# Altium schematic sheet CW308_Power.SchDoc: Target Linear Regulators
size Letter; ApprovedBy: N; Organization: NewAE Technology Inc.; Address1: 1083 Queen St., Suite 196; Address2: Halifax; Address3: NS; Address4: Canada B3H 0B2; DocumentNumber: 3; SheetNumber: 3; SheetTotal: 5; SheetApproved: YES
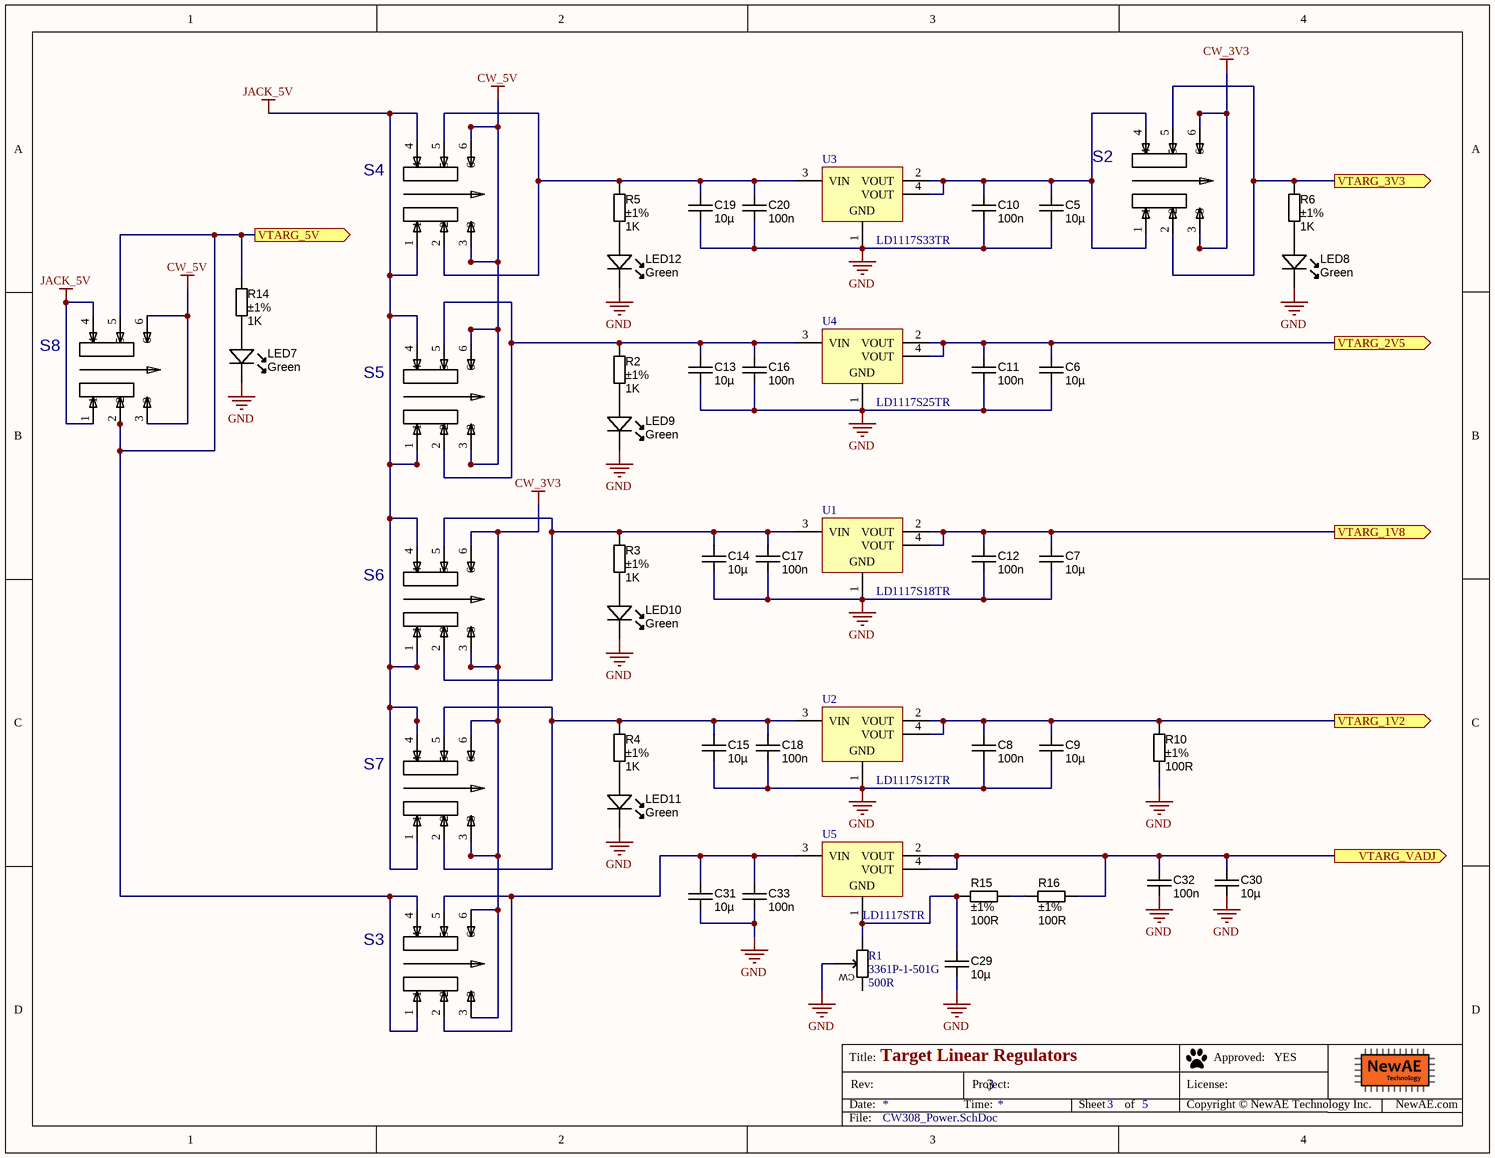
[diagram p0: CW308_Power.SchDoc]

## Parts
C5  value 10µ  [CAPC2012X135N]  (hidden comment: approved sub OK)
C6  value 10µ  [CAPC2012X135N]  (hidden comment: approved sub OK)
C7  value 10µ  [CAPC2012X135N]  (hidden comment: approved sub OK)
C8  value 100n  [CAPC1608X90N]  (hidden comment: approved sub OK)
C9  value 10µ  [CAPC2012X135N]  (hidden comment: approved sub OK)
C10  value 100n  [CAPC1608X90N]  (hidden comment: approved sub OK)
C11  value 100n  [CAPC1608X90N]  (hidden comment: approved sub OK)
C12  value 100n  [CAPC1608X90N]  (hidden comment: approved sub OK)
C13  value 10µ  [CAPC2012X135N]  (hidden comment: approved sub OK)
C14  value 10µ  [CAPC2012X135N]  (hidden comment: approved sub OK)
C15  value 10µ  [CAPC2012X135N]  (hidden comment: approved sub OK)
C16  value 100n  [CAPC1608X90N]  (hidden comment: approved sub OK)
C17  value 100n  [CAPC1608X90N]  (hidden comment: approved sub OK)
C18  value 100n  [CAPC1608X90N]  (hidden comment: approved sub OK)
C19  value 10µ  [CAPC2012X135N]  (hidden comment: approved sub OK)
C20  value 100n  [CAPC1608X90N]  (hidden comment: approved sub OK)
C29  value 10µ  [CAPC2012X135N]  (hidden comment: approved sub OK)
C30  value 10µ  [CAPC2012X135N]  (hidden comment: approved sub OK)
C31  value 10µ  [CAPC2012X135N]  (hidden comment: approved sub OK)
C32  value 100n  [CAPC1608X90N]  (hidden comment: approved sub OK)
C33  value 100n  [CAPC1608X90N]  (hidden comment: approved sub OK)
LED7  Green  [LED-0603-GREEN]
LED8  Green  [LED-0603-GREEN]
LED9  Green  [LED-0603-GREEN]
LED10  Green  [LED-0603-GREEN]
LED11  Green  [LED-0603-GREEN]
LED12  Green  [LED-0603-GREEN]
R1  3361P-1-501G  value 500R  [BOURNS-3361P]
R2  value 1K  Tolerance: ±1%  [RESC1608X55N]  (hidden comment: Thick Film)
R3  value 1K  Tolerance: ±1%  [RESC1608X55N]  (hidden comment: Thick Film)
R4  value 1K  Tolerance: ±1%  [RESC1608X55N]  (hidden comment: Thick Film)
R5  value 1K  Tolerance: ±1%  [RESC1608X55N]  (hidden comment: Thick Film)
R6  value 1K  Tolerance: ±1%  [RESC1608X55N]  (hidden comment: Thick Film)
R10  value 100R  Tolerance: ±1%  [RESC1608X55N]  (hidden comment: Thick Film)
R14  value 1K  Tolerance: ±1%  [RESC1608X55N]  (hidden comment: Thick Film)
R15  value 100R  Tolerance: ±1%  [RESC1608X55N]  (hidden comment: Thick Film)
R16  value 100R  Tolerance: ±1%  [RESC1608X55N]  (hidden comment: Thick Film)
S2  JS202011SCQN  [SW_JS202011SCQN]  (value not drawn)
S3  JS202011SCQN  [SW_JS202011SCQN]  (value not drawn)
S4  JS202011SCQN  [SW_JS202011SCQN]  (value not drawn)
S5  JS202011SCQN  [SW_JS202011SCQN]  (value not drawn)
S6  JS202011SCQN  [SW_JS202011SCQN]  (value not drawn)
S7  JS202011SCQN  [SW_JS202011SCQN]  (value not drawn)
S8  JS202011SCQN  [SW_JS202011SCQN]  (value not drawn)
U1  LD1117S18TR  [SOT-223_M]
U2  LD1117S12TR  [SOT-223_M]
U3  LD1117S33TR  [SOT-223_L]
U4  LD1117S25TR  [SOT-223_L]
U5  LD1117STR  [SOT-223_L]

## Ports
VTARG_1V2 (out), VTARG_1V8 (out), VTARG_2V5 (out), VTARG_3V3 (out), VTARG_5V (out), VTARG_VADJ (out)

## Nets
CW_3V3: S2.3 S2.6 S3.3 S3.6 S6.3 S6.6 S7.3 S7.6
CW_5V: S4.3 S4.6 S5.3 S5.6 S8.3 S8.6
GND: C5.2 C6.2 C7.2 C8.2 C9.2 C10.2 C11.2 C12.2 C13.2 C14.2 C15.2 C16.2 C17.2 C18.2 C19.2 C20.2 C29.2 C30.2 C31.2 C32.2 C33.2 LED7.K LED8.K LED9.K LED10.K LED11.K LED12.K R1.W R10.1 U1.1(GND) U2.1(GND) U3.1(GND) U4.1(GND)
JACK_5V: S4.1 S4.4 S5.1 S5.4 S6.1 S6.4 S7.1 S7.4 S8.1 S8.4
VTARG_1V2: C8.1 C9.1 R10.2 U2.2(VOUT) U2.4(VOUT) ; port VTARG_1V2
VTARG_1V8: C7.1 C12.1 U1.2(VOUT) U1.4(VOUT) ; port VTARG_1V8
VTARG_2V5: C6.1 C11.1 U4.2(VOUT) U4.4(VOUT) ; port VTARG_2V5
VTARG_3V3: R6.2 S2.2 S2.5 ; port VTARG_3V3
VTARG_5V: R14.2 S3.1 S3.4 S8.2 S8.5 ; port VTARG_5V
VTARG_VADJ: C30.1 C32.1 R16.1 U5.2(VOUT) U5.4(VOUT) ; port VTARG_VADJ
NetC5_1: C5.1 C10.1 S2.1 S2.4 U3.2(VOUT) U3.4(VOUT)
NetC13_1: C13.1 C16.1 R2.2 S5.2 S5.5 U4.3(VIN)
NetC14_1: C14.1 C17.1 R3.2 S6.2 S6.5 U1.3(VIN)
NetC15_1: C15.1 C18.1 R4.2 S7.2 S7.5 U2.3(VIN)
NetC19_1: C19.1 C20.1 R5.2 S4.2 S4.5 U3.3(VIN)
NetC29_1: C29.1 R1.CCW R15.2 U5.1(GND)
NetC31_1: C31.1 C33.1 S3.2 S3.5 U5.3(VIN)
NetLED7_A: LED7.A R14.1
NetLED8_A: LED8.A R6.1
NetLED9_A: LED9.A R2.1
NetLED10_A: LED10.A R3.1
NetLED11_A: LED11.A R4.1
NetLED12_A: LED12.A R5.1
NetR15_1: R15.1 R16.2

Not connected (* = marked no-connect by the designer): R1 CW(3)

## Notes on the sheet
- Title:
- Date:
- Rev:
- Time:
- Project:
- Sheet
- of
- License:
- Copyright © NewAE Technology Inc.
- Approved:
- NewAE.com
- File:

## Library data of the parts
C5-C7 C9 C13-C15 C19 C29-C31 = CAPC_10u_0805_10V: Capacitor SMD Cer 10uF 10% 10V X5R 0805; Manufacturer 1: AVX Corporation; Manufacturer Part Number 1: 0805ZD106KAT2A; Ratings: 10V; X5R; Material: ceramic; SCDType: spec; Package / Case: 0805 (2012 metric); Tolerance: ±10%; Manufacturer 2: Kemet; Manufacturer Part Number 2: C0805C106K8PACTU; Supplier 1: Digi-Key; Supplier Part Number 1: 478-5167-1-ND; ComponentLink1URL: http://www.avx.com/docs/Catalogs/cx5r.pdf; ComponentLink1Description: http://www.avx.com/docs/Catalogs/cx5r.pdf; ComponentLink2URL: http://www.kemet.com/datasheets&C0805C106K8PACTU; ComponentLink2Description: http://www.kemet.com/datasheets&C0805C106K8PACTU; Supplier 2: Digi-Key; Supplier Part Number 2: 399-4925-1-ND
C8 C10-C12 C16-C18 C20 C32 C33 = CAPC_100n_0603_X7R_50V_10%: Capacitor SMD Cer 100nF 10% 50V X7R 0603; Manufacturer 1: AVX Corporation; Manufacturer Part Number 1: 06035C104KAT2A; Ratings: 50V; X7R; Material: ceramic; SCDType: spec; Manufacturer 2: TDK Corporation; Manufacturer Part Number 2: C1608X7R1H104K; Package / Case: 0603 (1608 Metric); Tolerance: ±10%; Supplier 1: Digi-Key; Supplier Part Number 1: 478-5052-1-ND; ComponentLink1URL: http://www.avx.com/docs/Catalogs/cx7r.pdf; ComponentLink1Description: http://www.avx.com/docs/Catalogs/cx7r.pdf; Supplier 2: Digi-Key; Supplier Part Number 2: 445-1314-1-ND; ComponentLink2URL: http://product.tdk.com/capacitor/mlcc/en/documents/mlcc_commercial_general_en.pdf; ComponentLink2Description: http://product.tdk.com/capacitor/mlcc/en/documents/mlcc_commercial_general_en.pdf
LED7-LED12 = LED_SMD_Green_0603_570nm: LED 0603 SMD Green 570nm 50mcd 20mA; Manufacturer 1: Kingbright Company LLC; Manufacturer Part Number 1: APT1608CGCK; Material: AlGaInP; Ratings: 20mcd min; 50 mcd typ; 570 nm; Voltage - Forward (Vf) Typ: 2.1V; Viewing Angle: 120°; Lens Style/Size: Rectangle with Flat Top, 1.1mm x 0.8mm; Voltage - Forward (Vf) @ 10mA: 2.0V; SCDType: source; Wavelength - Peak: 574nm; Lens Type: Clear; Package / Case: 0603 (1608 metric); Color: Green; Current - Test: 20mA; Supplier 1: Digi-Key; Supplier Part Number 1: 754-1116-1-ND; RoHS 1: RoHS Compliant; Wavelength - Dominant: 570nm; ComponentLink1URL: http://www.us.kingbright.com/images/catalog/SPEC/APT1608CGCK.pdf; ComponentLink1Description: http://www.us.kingbright.com/images/catalog/SPEC/APT1608CGCK.pdf
R1 = 3361P-1-501G: 500 ohm, single-turn trimmer; Manufacture 1: Bourns Inc; Manufacture Part Number 1: 3361P-1-501GLF; Supplier 1: Digi-Key; Supplier Part Number 1: 3361P-501GLFCT-ND
R2-R6 R14 = RES_1K_0603_1%: Resistor SMD chip 1k Ohm 0.1W 1% 0603; Manufacturer 1: Yageo; Manufacturer Part Number 1: RC0603FR-071KL; Ratings: 1/10W; SCDType: spec; Package / Case: 0603 (1608 Metric); Supplier 1: Digi-Key; Supplier Part Number 1: 311-1.00KHRCT-ND
R10 R15 R16 = RES_100R_0603_1%: Resistor SMD chip 100 Ohm 0.1W 1% 0603; Manufacturer 1: Yageo; Manufacturer Part Number 1: RC0603FR-07100RL; Ratings: 1/10 W; SCDType: spec; Package / Case: 0603 (1608 Metric); Material: Thick Film; Supplier 1: Digi-Key; Supplier Part Number 1: 311-100HRCT-ND; Supplier 2: Digi-Key; Supplier Part Number 2: P100HTR-ND; Manufacturer 2: Panasonic - ECG; Manufacturer Part Number 2: ERJ-3EKF1000V; ComponentLink1URL: http://industrial.panasonic.com/www-cgi/jvcr13pz.cgi?E+PZ+3+AOA0002+ERJ3EKF1000V+7+WW; ComponentLink1Description: http://industrial.panasonic.com/www-cgi/jvcr13pz.cgi?E+PZ+3+AOA0002+ERJ3EKF1000V+7+WW
S2-S8 = JS202011SCQN: DPDT SMD Switch, 300mA; Manufacture 1: C&K Components; Value: DPDT; Supplier 1: Digi-Key; Manufacture Part Number 1: JS202011SCQN; Supplier Part Number 1: 401-2002-1-ND
U1 = CMP-0244-00308-1: Fixed Low Drop Positive Voltage Regulator, 1.8V, 4-Pin SOT-223, Tape and Reel; ComponentLink1URL: http://www.st.com; PackageReference: SOT-223; PackageDescription: 4-Pin SOT-223 Package, 6.5 x 3.5 mm Body, 2.3 mm Pitch, 7 mm Lead Span; ComponentLink2URL: http://www.st.com/internet/com/TECHNICAL_RESOURCES/TECHNICAL_LITERATURE/DATASHEET/CD00000544.pdf; ComponentLink2Description: Datasheet; ComponentLink1Description: Manufacturer URL; DatasheetVersion: 1/11/2011; PackageVersion: 2010; Supplier 1: Digi-Key; Supplier Part Number 1: 497-7308-1-ND
U2 = CMP-0244-00318-1: Fixed Low Drop Positive Voltage Regulator, 1.2V, 4-Pin SOT-223, Tape and Reel; PackageDescription: 4-Pin SOT-223 Package, 6.5 x 3.5 mm Body, 2.3 mm Pitch, 7 mm Lead Span; PackageVersion: 2010; ComponentLink2Description: Datasheet; PackageReference: SOT-223; ComponentLink2URL: http://www.st.com/internet/com/TECHNICAL_RESOURCES/TECHNICAL_LITERATURE/DATASHEET/CD00000544.pdf; ComponentLink1Description: Manufacturer URL; DatasheetVersion: 1/11/2011; ComponentLink1URL: http://www.st.com; Supplier 1: Digi-Key; Supplier Part Number 1: 497-4240-1-ND
U3 = CMP-0244-00310-1: Fixed Low Drop Positive Voltage Regulator, 3.3V, 4-Pin SOT-223, Tape and Reel; ComponentLink2Description: Datasheet; PackageDescription: 4-Pin SOT-223 Package, 6.5 x 3.5 mm Body, 2.3 mm Pitch, 7 mm Lead Span; PackageVersion: 2010; ComponentLink2URL: http://www.st.com/internet/com/TECHNICAL_RESOURCES/TECHNICAL_LITERATURE/DATASHEET/CD00000544.pdf; PackageReference: SOT-223; DatasheetVersion: 1/11/2011; ComponentLink1Description: Manufacturer URL; ComponentLink1URL: http://www.st.com; Supplier 1: Digi-Key; Supplier Part Number 1: 497-1242-1-ND
U4 = CMP-0244-00306-1: Fixed Low Drop Positive Voltage Regulator, 4-Pin SOT-223, Tape and Reel; ComponentLink2URL: http://www.st.com/internet/com/TECHNICAL_RESOURCES/TECHNICAL_LITERATURE/DATASHEET/CD00000544.pdf; ComponentLink1URL: http://www.st.com; PackageVersion: 2010; DatasheetVersion: 1/11/2011; PackageDescription: 4-Pin SOT-223 Package, 6.5 x 3.5 mm Body, 2.3 mm Pitch, 7 mm Lead Span; ComponentLink1Description: Manufacturer URL; PackageReference: SOT-223; ComponentLink2Description: Datasheet; Supplier 1: Digi-Key; Supplier Part Number 1: 497-7309-1-ND
U5 = CMP-0244-00313-1: Adjustable Low Drop Voltage Regulator, 1.25 to 15V, 4-Pin SOT-223, Tape and Reel; ComponentLink2Description: Datasheet; PackageVersion: 2010; PackageReference: SOT-223; ComponentLink2URL: http://www.st.com/internet/com/TECHNICAL_RESOURCES/TECHNICAL_LITERATURE/DATASHEET/CD00000544.pdf; DatasheetVersion: 1/11/2011; ComponentLink1URL: http://www.st.com; PackageDescription: 4-Pin SOT-223 Package, 6.5 x 3.5 mm Body, 2.3 mm Pitch, 7 mm Lead Span; ComponentLink1Description: Manufacturer URL; Supplier 1: Digi-Key; Supplier Part Number 1: 497-1244-1-ND